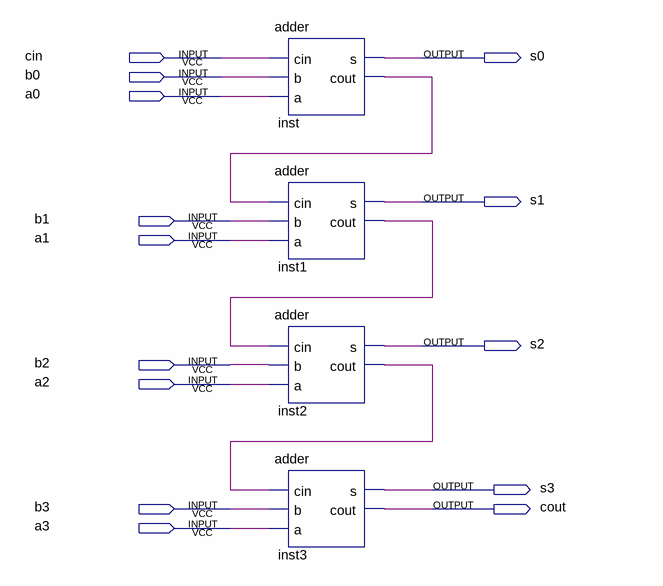
[diagram p0: schematic sheet]
// Quartus schematic fullAdder.bdf as structural Verilog: 4 symbols, 14 pins
module fullAdder (
  input  cin,
  input  b0,
  input  a0,
  input  b1,
  input  a1,
  input  b2,
  input  a2,
  input  b3,
  input  a3,
  output s0,
  output s1,
  output s2,
  output s3,
  output cout
);

  wire inst1_cout, inst2_cout, inst_cout;

  adder inst (.cin(cin), .b(b0), .a(a0), .s(s0), .cout(inst_cout));
  adder inst1 (.cin(inst_cout), .b(b1), .a(a1), .s(s1), .cout(inst1_cout));
  adder inst2 (.cin(inst1_cout), .b(b2), .a(a2), .s(s2), .cout(inst2_cout));
  adder inst3 (.cin(inst2_cout), .b(b3), .a(a3), .s(s3), .cout(cout));
endmodule
